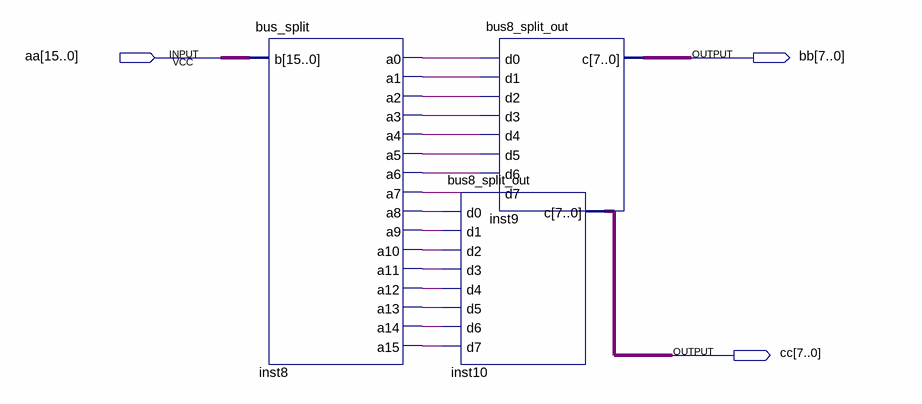
[diagram p0: schematic sheet]
// Quartus schematic bus16_8.bdf as structural Verilog: 3 symbols, 3 pins
module bus16_8 (
  input  [15:0] aa,
  output [7:0] bb,
  output [7:0] cc
);

  wire inst8_a0, inst8_a1, inst8_a2, inst8_a3, inst8_a4, inst8_a5, inst8_a6, inst8_a7, inst8_a8, inst8_a9,
       inst8_a10, inst8_a11, inst8_a12, inst8_a13, inst8_a14, inst8_a15;

  bus_split inst8 (
    .b(aa), .a0(inst8_a0), .a1(inst8_a1), .a2(inst8_a2), .a3(inst8_a3), .a4(inst8_a4), .a5(inst8_a5),
    .a6(inst8_a6), .a7(inst8_a7), .a8(inst8_a8), .a9(inst8_a9), .a10(inst8_a10), .a11(inst8_a11),
    .a12(inst8_a12), .a13(inst8_a13), .a14(inst8_a14), .a15(inst8_a15));
  bus8_split_out inst9 (
    .d0(inst8_a0), .d1(inst8_a1), .d2(inst8_a2), .d3(inst8_a3), .d4(inst8_a4), .d5(inst8_a5), .d6(inst8_a6),
    .d7(inst8_a7), .c(bb));
  bus8_split_out inst10 (
    .d0(inst8_a8), .d1(inst8_a9), .d2(inst8_a10), .d3(inst8_a11), .d4(inst8_a12), .d5(inst8_a13),
    .d6(inst8_a14), .d7(inst8_a15), .c(cc));
endmodule
